# EAGLE schematic LCD_Connection (EAGLE 9.4.2)
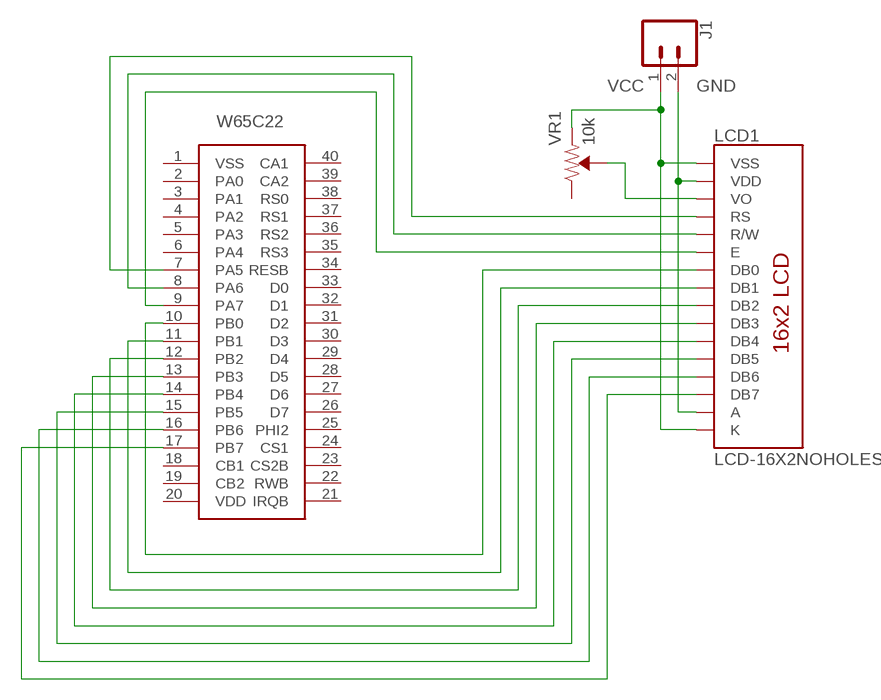
[diagram p0: schematic, sheet 1]

## Parts
J1  CONN_02POGO_PIN_HOLES_ONLY  [1X02_PP_HOLES_ONLY]
LCD1  LCD-16X2NOHOLES  [LCD-16X2_NOHOLESNOSILK]
U$1  W65C22  [DIP1150W53P250L4975H200Q40B]
VR1  10k  TRIMPOT-SMD-3MM-CLOSED-1/8W-20%  [TRIMPOT-SMD-3MM-CLOSED]

## Nets
GND: J1.2 LCD1.2(VDD) LCD1.15(A)
N$1: LCD1.7(DB0) U$1.10(PB0)
N$2: LCD1.8(DB1) U$1.11(PB1)
N$3: LCD1.9(DB2) U$1.12(PB2)
N$4: LCD1.10(DB3) U$1.13(PB3)
N$5: LCD1.11(DB4) U$1.14(PB4)
N$6: LCD1.12(DB5) U$1.15(PB5)
N$7: LCD1.13(DB6) U$1.16(PB6)
N$8: LCD1.14(DB7) U$1.17(PB7)
N$10: LCD1.6(E) U$1.9(PA7)
N$12: LCD1.5(R/W) U$1.8(PA6)
N$13: LCD1.3(VO) VR1.2(WIPER)
N$14: LCD1.4(RS) U$1.7(PA5)
VCC: J1.1 LCD1.1(VSS) LCD1.16(K) VR1.1(CCW)
Unconnected: U$1.1(VSS) U$1.2(PA0) U$1.3(PA1) U$1.4(PA2) U$1.5(PA3) U$1.6(PA4) U$1.18(CB1) U$1.19(CB2) U$1.20(VDD) U$1.21(IRQB) U$1.22(RWB) U$1.23(CS2B) U$1.24(CS1) U$1.25(PHI2) U$1.26(D7) U$1.27(D6) U$1.28(D5) U$1.29(D4) U$1.30(D3) U$1.31(D2) U$1.32(D1) U$1.33(D0) U$1.34(RESB) U$1.35(RS3) U$1.36(RS2) U$1.37(RS1) U$1.38(RS0) U$1.39(CA2) U$1.40(CA1) VR1.3(CW)

## Library data of the parts
J1 = SparkFun-Connectors:CONN_02: Multi connection point. Often used as Generic Header-pin footprint for 0.1 inch spaced/style header connections On any of the 0.1 inch spaced packages, you can populate with these: Break Away Headers - Straight <https://www.sparkfun.com/products/116> (PRT-00116) Break Away Male Headers - Right Angle <https://www.sparkfun.com/products/553> (PRT-00553) Female Headers <https://www.sparkfun.com/products/115> (PRT-00115) Break Away Headers - Machine Pin <https://www.sparkfun.com/products/117> (PRT-00117) Break Away Female Headers - Swiss Machine Pin <https://www.sparkfun.com/products/743> (PRT-00743) For SCREWTERMINALS and SPRING TERMINALS visit here: Screw Terimnals on SparkFun.com <https://www.sparkfun.com/search/results?term=Screw+Terminals> (5mm/3.5mm/2.54mm spacing) This device is also useful as a general connection point to wire up your design to another part of your project. Our various solder wires solder well into these plated through hole pads. Hook-Up Wire - Assortment (Stranded, 22 AWG) <https://www.sparkfun.com/products/11375> (PRT-11375) Hook-Up Wire - Assortment (Solid Core, 22 AWG) <https://www.sparkfun.com/products/11367> (PRT-11367) View the entire wire category on our website here <https://www.sparkfun.com/categories/141> Special notes: Molex polarized connector foot print use with: PRT-08233 with associated crimp pins and housings. 2.54_SCREWTERM for use with PRT-10571. 3.5mm Screw Terminal footprints for PRT-08084 5mm Screw Terminal footprints for use with PRT-08432
LCD1 = SparkFun-Displays:LCD-16X2: Standard text-only 16x2 parallel input LCD Basic 16 character by 2 line display. Typically utilizes the extremely common HD44780 parallel interface chipset SparkFun Products: Basic 16x2 Green <https://www.sparkfun.com/products/255> Basic 8x2 Green <https://www.sparkfun.com/products/11122>; SF_ID: LCD-00255
U$1 = Computer_Parts:W65C22
VR1 = SparkFun-Resistors:TRIMPOT: Trimming Potentiometer (Trimpot) Three-terminal potentiometers, with an adjustable wiper and two adjustable resistors. A pot can be used to create a configurable voltage divider, or as a variable resistor. "Trimpots" are a subset of potentiometers, usually intended for "set-and-forget" applications. They're often more delicate than standard potentiometers - rated for fewer turns. Variants PTH-KNOB - PTH Trimpot w/ finger-adjustable knob Trimpot 10K with Knob <https://www.sparkfun.com/products/9806> (COM-09806) Datasheet <http://www.sparkfun.com/datasheets/Components/General/TSR-3386.pdf> SMD-3MM-CLOSED-FRAME - SMD 3mm Square Closed-Frame Trimpot Used on e.g. EasyDriver - Stepper Motor Driver <https://www.sparkfun.com/products/12779> Datasheet <http://www.bitechnologies.com/pdfs/22.pdf> (22AR10KTR) SMD-5MM - SMD 5mm Square Closed-Frame Trimpot Used on e.g. IOIO-OTG - V2.2 <https://www.sparkfun.com/products/13613> Datasheet <http://www.vishay.com/docs/51008/ts53.pdf> (TS53YL502MR10) SMD-3MM-1/10W-25% - 3mm Square Open-Frame Trimpot Used on e.g. SparkFun Shapeoko <https://www.sparkfun.com/products/13899> Datasheet <http://www.bourns.com/docs/Product-Datasheets/TC33.pdf> (TC33X-2-103E); PROD_ID: RES-09285